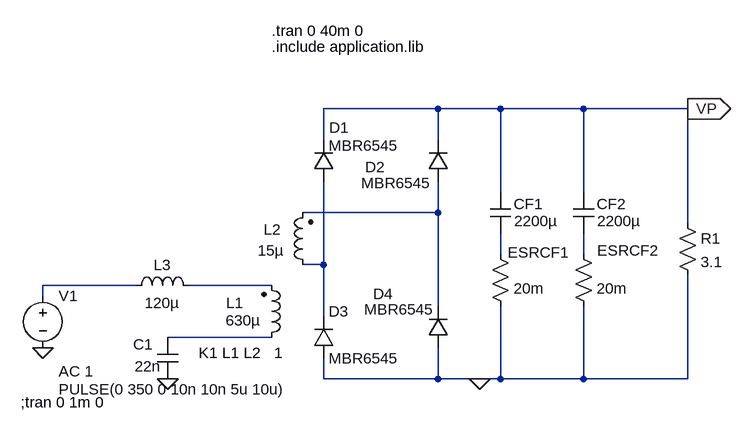
[diagram p0: schematic ac.asc]
ac.asc, the LTspice schematic file:
Version 4
SHEET 1 880 680
WIRE 64 -192 -112 -192
WIRE 160 -192 64 -192
WIRE 288 -192 160 -192
WIRE 448 -192 288 -192
WIRE -112 -144 -112 -192
WIRE 64 -144 64 -192
WIRE 160 -64 160 -192
WIRE 288 -64 288 -192
WIRE 64 -32 64 -80
WIRE 64 -32 -144 -32
WIRE 448 -16 448 -192
WIRE 160 32 160 0
WIRE 288 32 288 0
WIRE -112 48 -112 -80
WIRE -112 48 -144 48
WIRE -400 80 -544 80
WIRE -192 80 -320 80
WIRE -544 96 -544 80
WIRE 64 112 64 -32
WIRE -112 128 -112 48
WIRE -192 160 -352 160
WIRE -112 224 -112 192
WIRE 64 224 64 176
WIRE 64 224 -112 224
WIRE 128 224 64 224
WIRE 160 224 160 112
WIRE 160 224 128 224
WIRE 288 224 288 112
WIRE 288 224 160 224
WIRE 448 224 448 64
WIRE 448 224 288 224
FLAG 448 -192 VP
IOPIN 448 -192 Out
FLAG -352 224 0
FLAG 128 224 0
FLAG -544 176 0
SYMBOL ind2 -208 176 M180
WINDOW 0 -54 69 Left 0
WINDOW 3 -55 42 Left 0
SYMATTR InstName L1
SYMATTR Value 630µ
SYMATTR Type ind
SYMATTR SpiceLine Rser=100m
SYMBOL ind2 -128 64 R180
WINDOW 0 49 70 Left 0
WINDOW 3 45 38 Left 0
SYMATTR InstName L2
SYMATTR Value 15µ
SYMATTR Type ind
SYMATTR SpiceLine Rser=10m
SYMBOL cap 144 -64 R0
WINDOW 0 36 19 Left 0
WINDOW 3 37 45 Left 0
SYMATTR InstName CF1
SYMATTR Value 2200µ
SYMBOL res 144 16 R0
WINDOW 0 27 13 Left 0
WINDOW 3 36 69 Left 0
SYMATTR InstName ESRCF1
SYMATTR Value 20m
SYMBOL diode -96 -80 R180
WINDOW 0 -23 83 Left 0
WINDOW 3 -99 55 Left 0
SYMATTR InstName D1
SYMATTR Value MBR6545
SYMBOL diode 80 -80 R180
WINDOW 0 97 22 Left 0
WINDOW 3 27 -2 Left 0
SYMATTR InstName D2
SYMATTR Value MBR6545
SYMBOL diode -128 192 M180
WINDOW 0 24 72 Left 0
WINDOW 3 24 0 Left 0
SYMATTR InstName D3
SYMATTR Value MBR6545
SYMBOL diode 48 176 M180
WINDOW 0 -84 83 Left 0
WINDOW 3 -98 59 Left 0
SYMATTR InstName D4
SYMATTR Value MBR6545
SYMBOL res 432 -32 R0
SYMATTR InstName R1
SYMATTR Value 3.1
SYMBOL ind -416 96 R270
WINDOW 0 32 56 VTop 0
WINDOW 3 5 56 VBottom 0
SYMATTR InstName L3
SYMATTR Value 120µ
SYMBOL cap -368 160 R0
WINDOW 0 -37 11 Left 0
WINDOW 3 -35 45 Left 0
SYMATTR InstName C1
SYMATTR Value 22n
SYMBOL cap 272 -64 R0
WINDOW 0 36 19 Left 0
WINDOW 3 37 45 Left 0
SYMATTR InstName CF2
SYMATTR Value 2200µ
SYMBOL res 272 16 R0
WINDOW 0 37 10 Left 0
WINDOW 3 36 69 Left 0
SYMATTR InstName ESRCF2
SYMATTR Value 20m
SYMBOL voltage -544 80 R0
WINDOW 3 24 160 Left 0
WINDOW 123 24 132 Left 0
WINDOW 39 0 0 Left 0
SYMATTR InstName V1
SYMATTR Value PULSE(0 350 0 10n 10n 5u 10u)
SYMATTR Value2 AC 1
TEXT -304 184 Left 0 !K1 L1 L2   1
TEXT -192 -288 Left 0 !.include application.lib
TEXT -192 -312 Left 0 !.tran 0 40m 0
TEXT -578 260 Left 0 !;tran 0 1m 0

The netlist it stands for:
* ac.asc
L1 N007 N006 630µ Rser=100m
L2 N004 N001 15µ Rser=10m
CF1 VP N002 2200µ
R§ESRCF1 N002 0 20m
D1 N004 VP MBR6545
D2 N001 VP MBR6545
D3 0 N004 MBR6545
D4 0 N001 MBR6545
R1 VP 0 3.1
L3 N005 N006 120µ
C1 N007 0 22n
CF2 VP N003 2200µ
R§ESRCF2 N003 0 20m
V1 N005 0 PULSE(0 350 0 10n 10n 5u 10u) AC 1
.model D D
.lib standard.dio
K1 L1 L2   1
.include application.lib
.tran 0 40m 0
;tran 0 1m 0
.backanno
.end